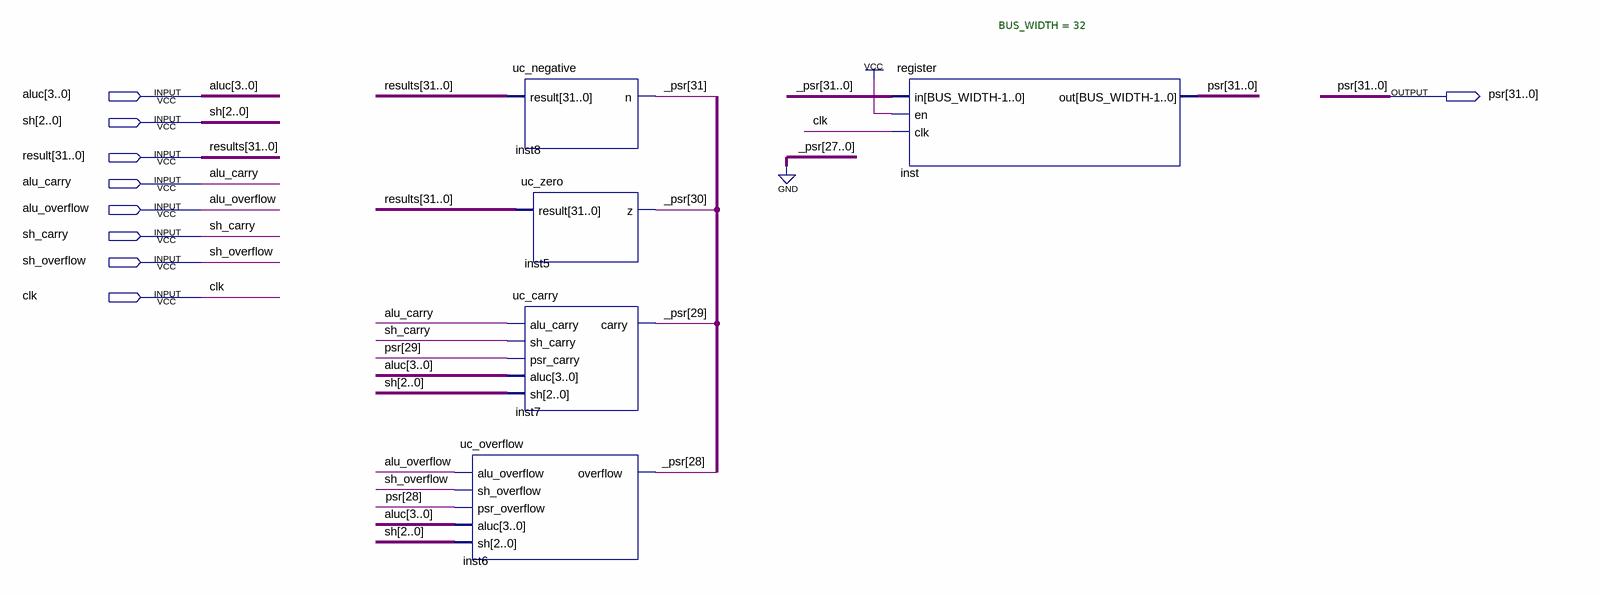
[diagram p0: schematic sheet]
// Quartus schematic uc_psr.bdf as structural Verilog: 5 symbols, 9 pins
module uc_psr (
  input  [3:0] aluc,
  input  [2:0] sh,
  input  [31:0] result,
  input  alu_carry,
  input  alu_overflow,
  input  sh_carry,
  input  sh_overflow,
  input  clk,
  output [31:0] psr
);

  wire [31:28] _psr;

  uc_overflow inst6 (
    .alu_overflow(alu_overflow), .sh_overflow(sh_overflow), .psr_overflow(psr[28]), .aluc(aluc), .sh(sh),
    .overflow(_psr[28]));
  uc_negative inst8 (.result(result), .n(_psr[31]));
  uc_zero inst5 (.result(result), .z(_psr[30]));
  uc_carry inst7 (
    .alu_carry(alu_carry), .sh_carry(sh_carry), .psr_carry(psr[29]), .aluc(aluc), .sh(sh), .carry(_psr[29]));
  register #(.BUS_WIDTH(32)) inst (.in({_psr, {28{1'b0}}}), .en(1'b1), .clk(clk), .out(psr));

  // Other names for the same wires on the sheet: results[31:0] = result
endmodule
